# EAGLE design lc2p (EAGLE 9.6.2)
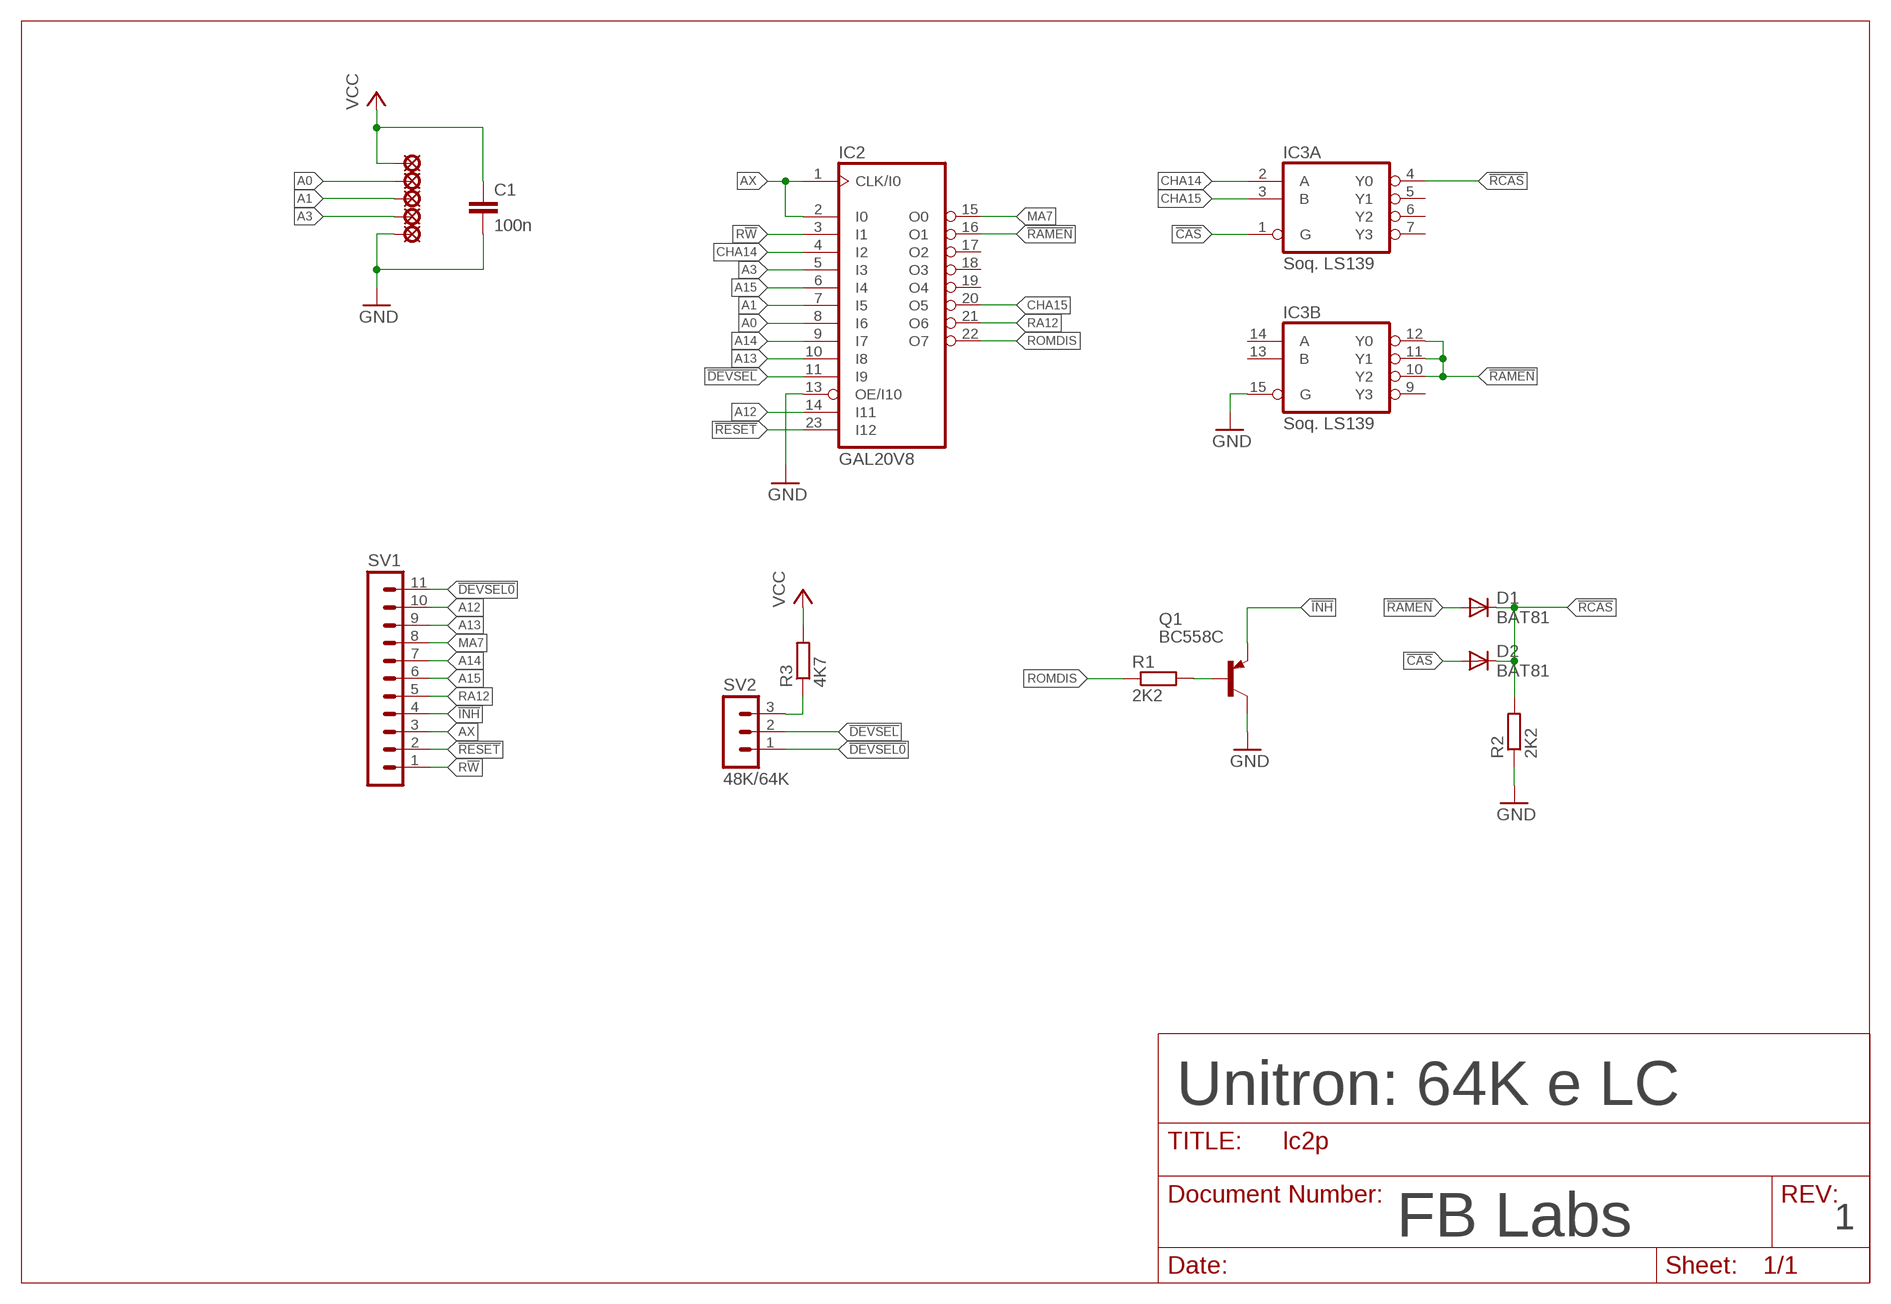
[diagram p0: schematic, sheet 1]

## Parts
C1  100n  C-EU050-024X044  [C050-024X044]
D1  BAT81  [DO34-7]
D2  BAT81  [DO34-7]
IC2  GAL20V8  20V8  [DIL24-3]
IC3  Soq. LS139  74AC139N  [DIL16]
LSP1  LSP10  [LSP10]
LSP2  LSP10  [LSP10]
LSP3  LSP10  [LSP10]
LSP4  LSP10  [LSP10]
LSP5  LSP10  [LSP10]
Q1  BC558C  [TO92-EBC]
R1  2K2  R-EU_0207/7  [0207/7]
R2  2K2  R-EU_0207/7  [0207/7]
R3  4K7  R-EU_0207/7  [0207/7]
SV1  MA11-1  [MA11-1]
SV2  48K/64K  MA03-1MA03-1-1  [MA03-1-1]

## Nets
!CAS: D2.A IC3.1(A:G)
!DEVSEL: IC2.11(I9) SV2.2
!DEVSEL0: SV1.11 SV2.1
!INH: Q1.E SV1.4
!RAMEN: D1.A IC2.16(O1) IC3.10(B:Y2) IC3.11(B:Y1) IC3.12(B:Y0)
!RCAS: D1.C D2.C IC3.4(A:Y0) R2.2
!RESET: IC2.23(I12) SV1.2
A0: IC2.8(I6) LSP1.MP
A1: IC2.7(I5) LSP2.MP
A3: IC2.5(I3) LSP3.MP
A12: IC2.14(I11) SV1.10
A13: IC2.10(I8) SV1.9
A14: IC2.9(I7) SV1.7
A15: IC2.6(I4) SV1.6
AX: IC2.1(CLK/I0) IC2.2(I0) SV1.3
CHA14: IC2.4(I2) IC3.2(A:A)
CHA15: IC2.20(O5) IC3.3(A:B)
GND: C1.2 IC2.13(OE/I10) IC3.15(B:G) LSP4.MP Q1.C R2.1
MA7: IC2.15(O0) SV1.8
N$1: R3.1 SV2.3
N$2: Q1.B R1.2
R!W: IC2.3(I1) SV1.1
RA12: IC2.21(O6) SV1.5
ROMDIS: IC2.22(O7) R1.1
VCC: C1.1 LSP5.MP R3.2
Unconnected: IC2.17(O2) IC2.18(O3) IC2.19(O4) IC3.5(A:Y1) IC3.6(A:Y2) IC3.7(A:Y3) IC3.9(B:Y3) IC3.13(B:B) IC3.14(B:A)

## Notes on the sheet
- Unitron: 64K e LC
- FB Labs | 1

## Power pins joined to a net without a drawn wire
GND: IC2.12(GND) IC3.8(P:GND)
VCC: IC2.24(VCC) IC3.16(P:VCC)

## Library data of the parts
C1 = rcl2:C-EU: CAPACITOR, European symbol
D1 D2 = diode:BAT81: DIODE barrier diode
IC2 = comps:20V8: PAL; MF: FARNELL; MPN: GAL20V8B-25QP; OC_FARNELL: 3327462; OC_NEWARK: 70C8546
IC3 = comps:74*139: Dual 2-line to 4-line DECODER/DEMULTIPLEXER
LSP1-LSP5 = comps:LSP10: SOLDER PAD drill 1.0 mm, distributor Buerklin, 12H555
Q1 = transistor-pnp:BC558*: PNP Transistror
R1-R3 = rcl2:R-EU_: RESISTOR, European symbol
SV1 = comps:MA11-1: PIN HEADER; OC_FARNELL: unknown; OC_NEWARK: unknown
SV2 = comps:MA03-1: PIN HEADER

## Board
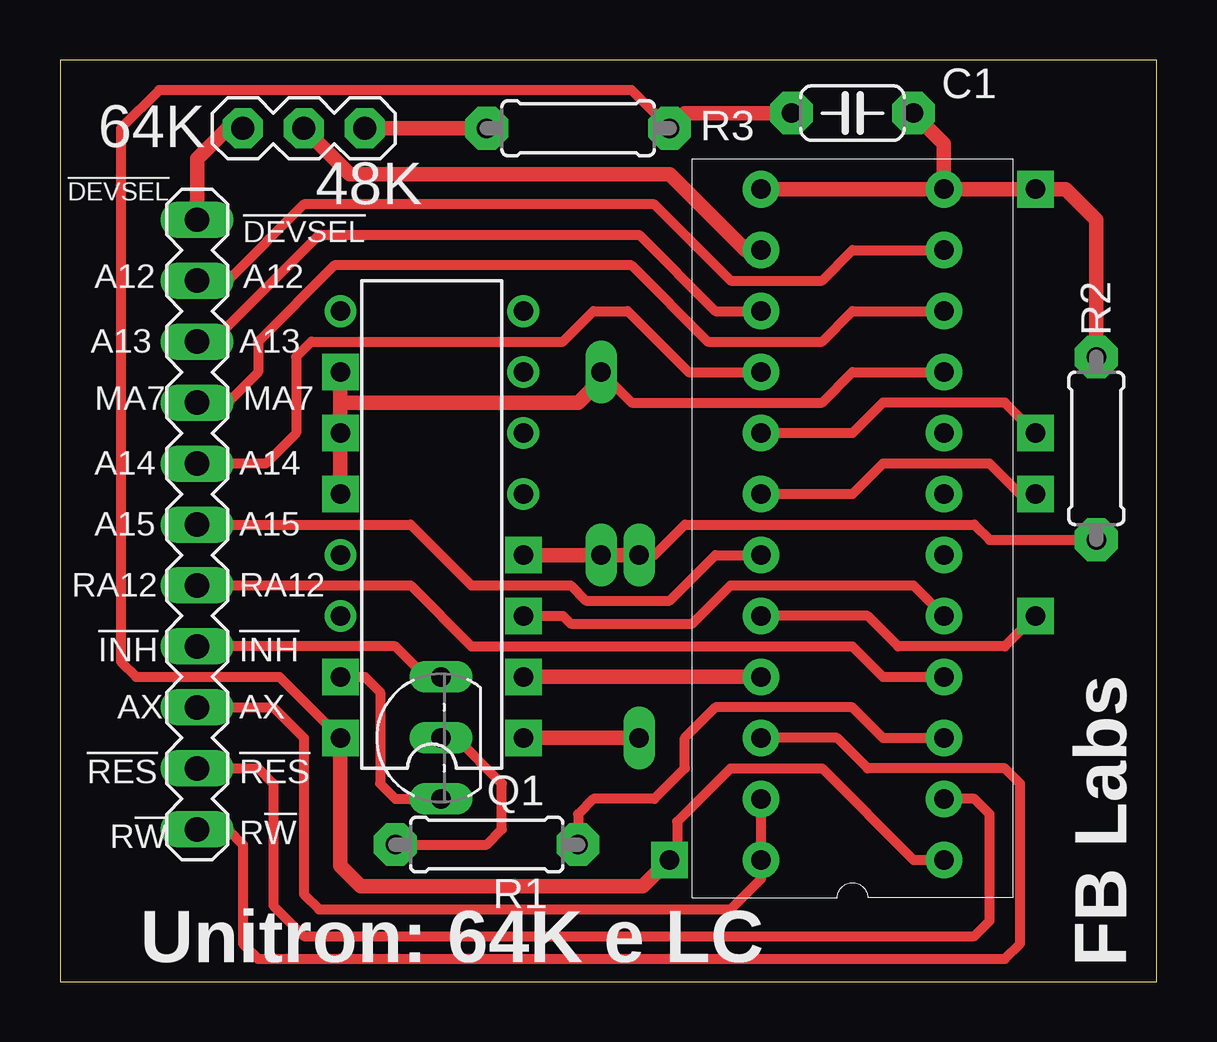
[diagram p1: board, top side]
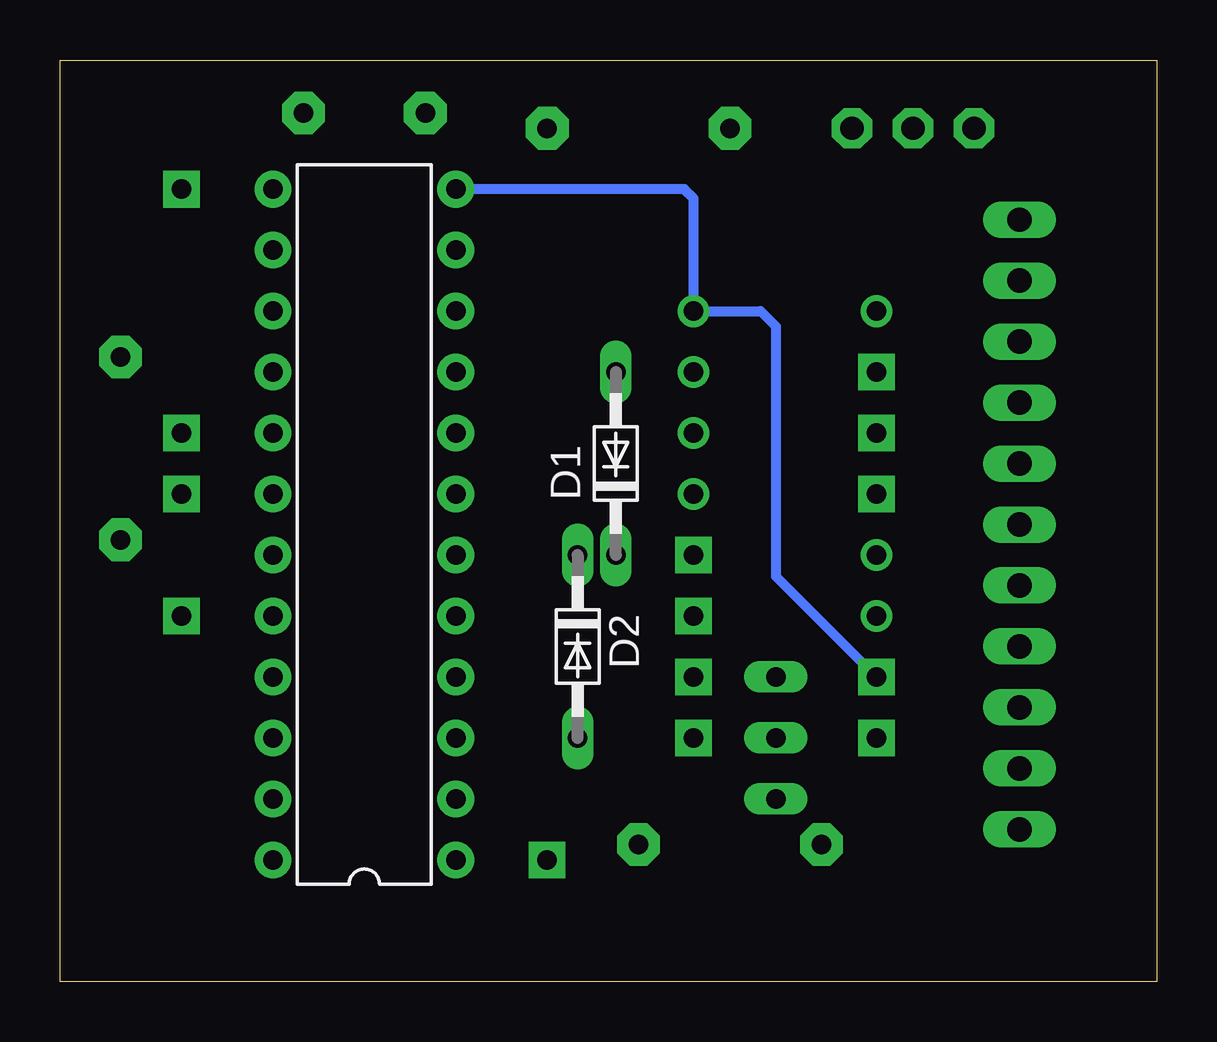
[diagram p2: board, bottom side, seen from below]

Size 45.7 x 38.41 mm. Coordinates in mm from the lower left corner, seen from the top.
Outline: 0,0 45.7,0 45.7,38.41 0,38.41 0,0
Copper layers (1*16): Top 0.035mm / dielectric 1.5mm / Bottom 0.035mm
Design rules "Impressao Laser": minimum track width 10mil, minimum drill 23mil, track to track 10mil, track to pad 10mil, pad to pad 10mil, via to via 10mil, smd to smd 10mil, copper to edge 20mil, drill to drill 10mil, minimum pad ring 10mil, minimum via ring 12mil, stop-mask expansion 4mil, vias tented up to drill 0mil, thermal gap 10mil

### Footprints (pad centres in the part's own frame; a part is rotated, then mirrored left to right if it is on the bottom)
C050-024X044 = drill 0.813 pad 1.778 octagon: 1 -2.54,0; 2 2.54,0
DO34-7 = drill 0.813 long: A 3.81,0; C -3.81,0
DIL24-3 = drill 0.813 pad 1.524: 1 -13.97,-3.81; 2 -11.43,-3.81; 3 -8.89,-3.81; 4 -6.35,-3.81; 5 -3.81,-3.81; 6 -1.27,-3.81; 7 1.27,-3.81; 8 3.81,-3.81; 9 6.35,-3.81; 10 8.89,-3.81; 11 11.43,-3.81; 12 13.97,-3.81; 13 13.97,3.81; 14 11.43,3.81; 15 8.89,3.81; 16 6.35,3.81; 17 3.81,3.81; 18 1.27,3.81; 19 -1.27,3.81; 20 -3.81,3.81; 21 -6.35,3.81; 22 -8.89,3.81; 23 -11.43,3.81; 24 -13.97,3.81
DIL16 = drill 0.813 pad 1.524 square: 1 -8.89,-3.81; 2 -6.35,-3.81; 3 -3.81,-3.81; 4 -1.27,-3.81; 10 6.35,3.81; 11 3.81,3.81; 12 1.27,3.81; 15 -6.35,3.81; 16 -8.89,3.81 | drill 0.813: 5 1.27,-3.81; 6 3.81,-3.81; 7 6.35,-3.81; 8 8.89,-3.81; 9 8.89,3.81; 13 -1.27,3.81; 14 -3.81,3.81
LSP10 = drill 0.813 pad 1.524 square: MP 0,0
TO92-EBC = drill 0.813 long: B 0,-1.27; C -2.54,-1.27; E 2.54,-1.27
0207/7 = drill 0.813 pad 1.778 octagon: 1 -3.81,0; 2 3.81,0
MA11-1 = drill 1.016 long: 1 -13.97,0; 2 -11.43,0; 3 -8.89,0; 4 -6.35,0; 5 -3.81,0; 6 -1.27,0; 7 1.27,0; 8 3.81,0; 9 6.35,0; 10 8.89,0; 11 11.43,0
MA03-1-1 = drill 0.965 pad 1.676 octagon: 1 -2.54,0; 2 0,0; 3 2.54,0

### Placement (x,y rotation side)
C1  33.02,36.2 0 top
D1  22.54,21.59 90 bottom
D2  24.13,13.97 270 bottom
IC2  33.02,19.05 90 bottom
IC3  15.49,19.05 90 top
LSP1  40.64,22.86 0 top
LSP2  40.64,20.32 0 top
LSP3  40.64,15.24 0 top
LSP4  40.64,33.02 0 top
LSP5  25.4,5.08 0 top
Q1  14.61,10.16 90 top
R1  17.78,5.71 180 top
R2  43.18,22.23 270 top
R3  21.59,35.56 0 top
SV1  5.71,20.32 90 top
SV2  10.16,35.56 0 top

### Tracks (layer width: path | path; a pad name or v marks a point on that pad's centre or on a via)
!CAS
  Top 0.61: D2.A IC3.1
!DEVSEL
  Top 0.61: SV2.2 12.06,33.66 25.4,33.66 28.57,30.48 IC2.11
!DEVSEL0
  Top 0.61: SV2.1 6.99,35.56 5.71,34.29 SV1.11
!INH
  Top 0.406: Q1.E 15.24,12.7 13.97,13.97 SV1.4
!RAMEN
  Top 0.406: IC2.16 33.02,25.4 31.75,24.13 23.81,24.13 D1.A 22.54,25.08
  Top 0.61: IC3.10 11.68,24.13 | 11.68,24.13 IC3.11 IC3.12 | 22.54,25.08 21.59,24.13 11.68,24.13
!RCAS
  Top 0.406: D2.C D1.C 24.77,17.78 26.04,19.05 38.1,19.05 38.73,18.41 R2.2
  Top 0.61: IC3.4 D2.C
!RESET
  Top 0.406: SV1.2 8.26,8.89 8.89,8.26 8.89,3.17 10.16,1.91 38.1,1.91 38.73,2.54 38.73,6.99 38.1,7.62 IC2.23
A0
  Top 0.406: LSP1.MP 39.37,24.13 34.29,24.13 33.02,22.86 IC2.8
A1
  Top 0.406: LSP2.MP 40.01,20.32 38.73,21.59 34.29,21.59 33.02,20.32 IC2.7
A3
  Top 0.406: LSP3.MP 39.37,13.97 34.92,13.97 33.66,15.24 IC2.5
A12
  Top 0.406: SV1.10 6.99,29.21 10.16,32.38 24.77,32.38 27.94,29.21 31.75,29.21 33.02,30.48 IC2.14
A13
  Top 0.406: SV1.9 6.35,26.67 10.79,31.11 24.13,31.11 27.3,27.94 IC2.10
A14
  Top 0.406: SV1.7 8.57,21.59 9.84,22.86 9.84,26.04 10.48,26.67 20.95,26.67 22.23,27.94 23.65,27.94 26.19,25.4 IC2.9
A15
  Top 0.406: SV1.6 14.61,19.05 17.14,16.51 21.27,16.51 21.91,15.88 25.4,15.88 27.3,17.78 IC2.6
AX
  Top 0.406: SV1.3 8.89,11.43 10.16,10.16 10.16,3.65 10.79,3.02 27.94,3.02 29.21,4.29 IC2.1 IC2.2
CHA14
  Top 0.61: IC3.2 IC2.4
CHA15
  Top 0.406: IC3.3 20.95,15.24 21.27,14.92 26.35,14.92 27.94,16.51 35.56,16.51 IC2.20
GND
  Top 0.406: IC3.15 12.7,12.7 13.34,12.06 13.34,8.26 13.97,7.62 Q1.C
  Top 0.61: IC2.13 LSP4.MP 41.91,33.02 43.18,31.75 R2.1 | IC2.13 IC2.12 | IC2.13 36.83,34.92 C1.2
  Bottom 0.406: IC3.15 15.88,16.89 15.88,27.3 16.51,27.94 IC3.8 19.3,32.64 19.68,33.02 IC2.12
MA7
  Top 0.406: SV1.8 6.99,24.13 8.26,25.4 8.26,26.67 11.43,29.84 23.81,29.84 26.99,26.67 31.75,26.67 33.02,27.94 IC2.15
N$1
  Top 0.61: SV2.3 R3.1
N$2
  Top 0.406: R1.2 17.78,5.71 18.41,6.35 18.41,8.26 16.51,10.16 Q1.B
R!W
  Top 0.406: SV1.1 6.99,6.35 7.62,5.71 7.62,1.59 8.26,0.95 39.37,0.95 40.01,1.59 40.01,8.26 39.37,8.89 33.66,8.89 32.38,10.16 IC2.3
RA12
  Top 0.406: SV1.5 14.61,16.51 17.14,13.97 33.02,13.97 34.29,12.7 IC2.21
ROMDIS
  Top 0.406: IC2.22 34.29,10.16 33.02,11.43 27.3,11.43 26.04,10.16 26.04,8.89 24.77,7.62 22.23,7.62 21.59,6.99 R1.1
VCC
  Top 0.406: LSP5.MP 25.72,5.4 25.72,6.67 27.94,8.89 31.75,8.89 35.56,5.08 IC2.24 | R3.2 23.81,37.15 4.13,37.15 2.54,35.56 2.54,13.34 3.17,12.7 9.14,12.7 IC3.16
  Top 0.61: IC3.16 11.68,4.83 12.54,3.97 24.29,3.97 LSP5.MP | C1.1 26.04,36.2 R3.2

### Text on the board
tPlace: 64K | !DEVSEL | 48K | !DEVSEL | A12 | A12 | A13 | A13 | MA7 | MA7 | A14 | A14 | A15 | A15 | RA12 | RA12 | !INH | !INH | AX | AX | !RES | !RES | R!W | R!W | Unitron: 64K e LC | FB Labs
fabio: !RAMEN | A0 | A1 | !RCAS | LS139 | CHA15 | A3 | CHA14 | !CAS | 1 | ROM